# Altium schematic sheet 06_POWER-INPUT.SchDoc
size A4; CheckedBy: Inženjer 2; CompanyName: Byte Lab Grupa d.o.o.; Engineer: Matija Puskar; Organization: Byte Lab Grupa d.o.o.; Address1: Medarska 69/1, 10000 Zagreb, Croatia; DocumentNumber: 1; SheetNumber: 6; SheetTotal: 7; Web: www.byte-lab.com; ProjectName: P1X-0XX
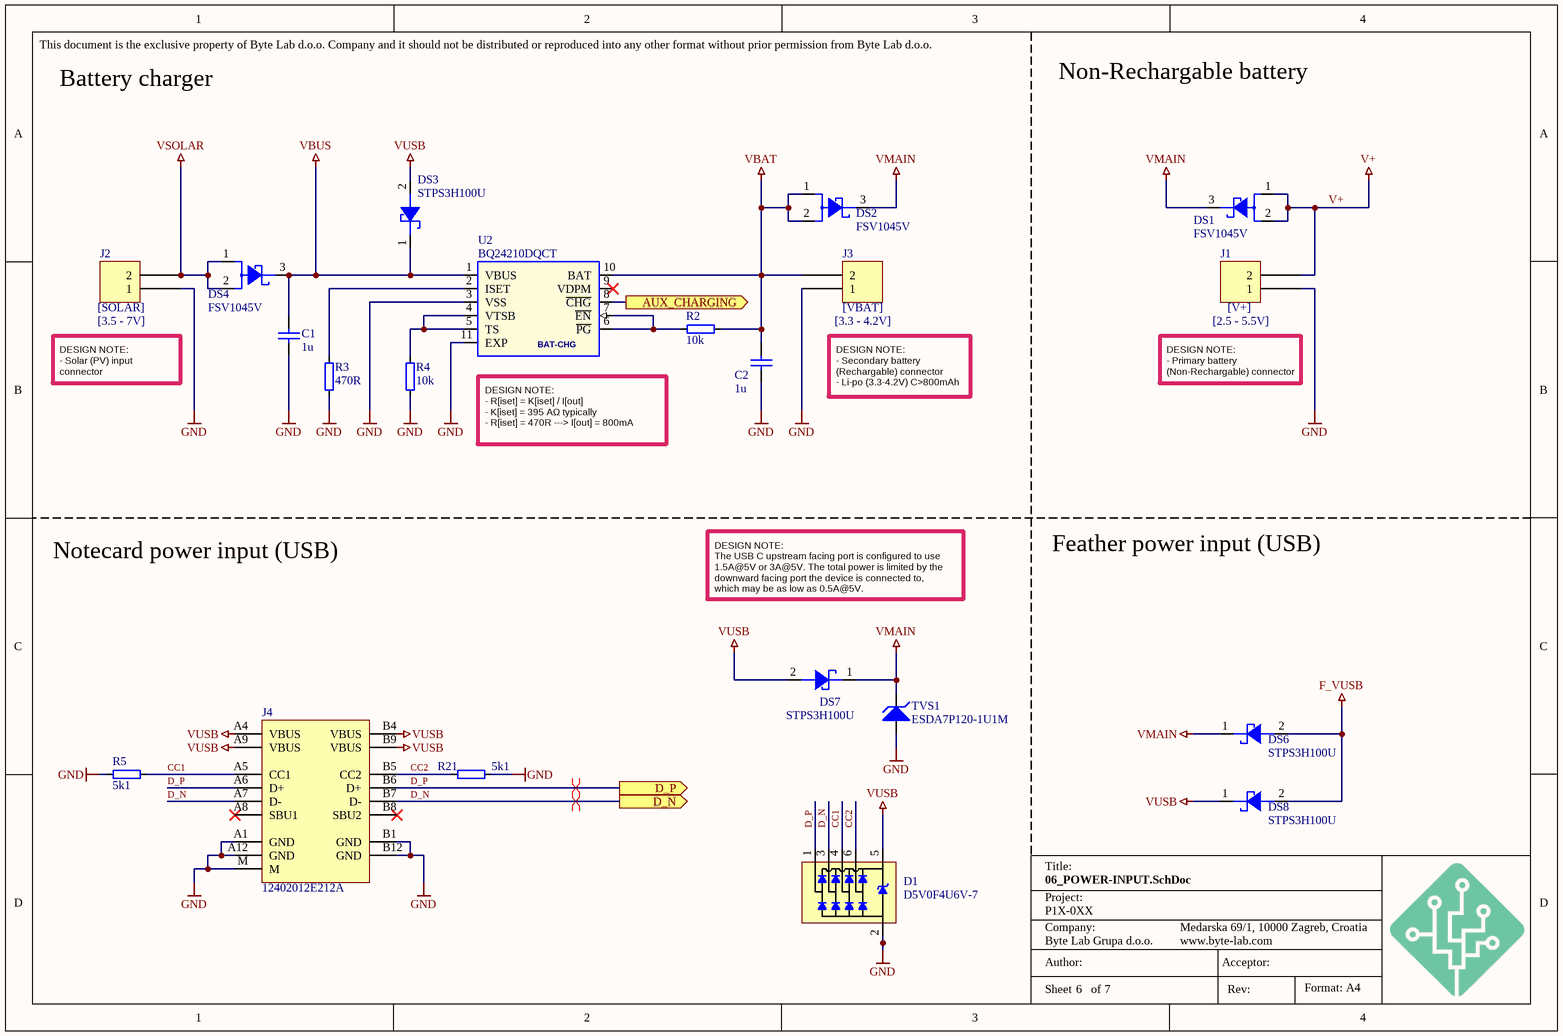
[diagram p0: 06_POWER-INPUT.SchDoc]

## Parts
C1  1u  [C-0603]
C2  1u  [C-0603]
D1  D5V0F4U6V-7  [SOT-563]
DS1  FSV1045V  [TO277-3]
DS2  FSV1045V  [TO277-3]
DS3  STPS3H100U  [SMB]
DS4  FSV1045V  [TO277-3]
DS6  STPS3H100U  [SMB]
DS7  STPS3H100U  [SMB]
DS8  STPS3H100U  [SMB]
J1  S2BPHSM4TBLFSN  [JST S2B-PH-SM4-TB]  (value not drawn)
J2  S2BPHSM4TBLFSN  [JST S2B-PH-SM4-TB]  (value not drawn)
J3  S2BPHSM4TBLFSN  [JST S2B-PH-SM4-TB]  (value not drawn)
J4  12402012E212A  [CONN_12402012E212A]
R2  10k  [R-0402]
R3  470R  [R-0402]
R4  10k  [R-0402]
R5  5k1  [R-0402]
R21  5k1  [R-0402]
TVS1  ESDA7P120-1U1M  [DIOC_160X100X60]
U2  BQ24210DQCT  [WSON10-EXP]

## Ports
AUX_CHARGING (out), D_N (out), D_P (out)

## Nets
F_VUSB: DS6.2(A) DS8.2(A)
GND: C1.1 C2.1 D1.2(GND) J1.1 J2.1 J3.1 J4.A1(GND) J4.A12(GND) J4.B1(GND) J4.B12(GND) J4.M R3.1 R4.1 R5.1 R21.2 TVS1.1(A) U2.3(VSS) U2.11(EXP)
V+: DS1.1(A1) DS1.2(A2) J1.2
VBAT: C2.2 DS2.1(A1) DS2.2(A2) J3.2 R2.2 U2.10(BAT)
VBUS: C1.2 DS3.1(C) DS4.3(C) U2.1(VBUS)
VMAIN: DS1.3(C) DS2.3(C) DS6.1(C) DS7.1(C) TVS1.2(K)
VSOLAR: DS4.1(A1) DS4.2(A2) J2.2
VUSB: D1.5(VDD) DS3.2(A) DS7.2(A) DS8.1(C) J4.A4(VBUS) J4.A9(VBUS) J4.B4(VBUS) J4.B9(VBUS)
AUX_CHARGING: U2.8(~{CHG}) ; port AUX_CHARGING
CC1: D1.4(CH3) J4.A5(CC1) R5.2
CC2: D1.6(CH4) J4.B5(CC2) R21.1
D_N: D1.3(CH2) J4.A7(D-) J4.B7(D-) ; port D_N
D_P: D1.1(CH1) J4.A6(D+) J4.B6(D+) ; port D_P
NetR2_1: R2.1 U2.6(~{PG}) U2.7(~{EN})
NetR3_2: R3.2 U2.2(ISET)
NetR4_2: R4.2 U2.4(VTSB) U2.5(TS)

Not connected (* = marked no-connect by the designer): J4 A8(SBU1)* B8(SBU2)*; U2 9(VDPM)*

## Layout directives
differential pair: D_N, D_P

## Notes on the sheet
- Battery charger
- Non-Rechargable battery
- (near J2) [SOLAR]
- (near J3) [VBAT]
- (near J1) [V+]
- DESIGN NOTE:
  - Solar (PV) input connector
- (near J2) [3.5 - 7V]
- (near J3) [3.3 - 4.2V]
- DESIGN NOTE:
  - Secondary battery (Rechargable) connector
  - Li-po (3.3-4.2V) C>800mAh
- DESIGN NOTE:
  - Primary battery (Non-Rechargable) connector
- (near J1) [2.5 - 5.5V]
- DESIGN NOTE:
  - R[iset] = K[iset] / I[out]
  - K[iset] = 395 AΩ typically
  - R[iset] = 470R ---> I[out] = 800mA
- Notecard power input (USB)
- Feather power input (USB)
- DESIGN NOTE:
  The USB C upstream facing port is configured to use 1.5A@5V or 3A@5V. The total power is limited by the downward facing port the device is connected to, which may be as low as 0.5A@5V.
- This document is the exclusive property of Byte Lab d.o.o. Company and it should not be distributed or reproduced into any other format without prior permission from Byte Lab d.o.o.
- Project:
- Title:
- Author:
- Company:
- Acceptor:
- Format: A4
- Sheet
- of
- Rev:
- (in symbol BAT-CHARGE - BQ24210DQCT) BAT-CHG

## Library data of the parts
C1 C2 = C0603-1u-25V-X5R: Capacitor ceramic 1u ±10% X5R 25V; Manufacturer: Yageo; BL Part Number: 2006-223; Manufacturer Part Number: CC0603KRX5R8BB105; Drawn_By: Hamin; Checked_By: Golubic; Supplier 1: Digi-Key; Supplier Part Number 1: 311-1445-1-ND; Note: *; DateModified: 2022-10-07
D1 = D5V0F4U6V-7: TVS DIODE 5.5VWM 12VC SOT563; BL Part Number: 2010-391; Manufacturer: Diodes Incorporated; Drawn_By: Duracic; Checked_By: Hrastic; Note: *; Manufacturer Part Number: D5V0F4U6V-7; DateModified: 21-01-2026; Supplier 1: *; Supplier Part Number 1: *
DS1 DS2 DS4 = SCHOTTKY - FSV1045V - 10A/45V: DIODO SCHOTTKY 10A 45V FSV1045V TO277-3 SMT; BL Part Number: 2007-712; Manufacturer: onsemi; Drawn_By: Blues Wireless; Supplier 1: Digi-Key; Supplier Part Number 1: FSV1045VCT-ND; Manufacturer Part Number: FSV1045V
DS3 DS6-DS8 = SCHOTTKY-STPS3H100U - 3A/100V: DIODO SCHOTTKY 3A 100V STPS3H100U SMB SMT; Manufacturer: STMicroelectronics; BL Part Number: 2007-711; Drawn_By: Blues Wireless; Supplier 1: Digi-Key; Supplier Part Number 1: 497-10392-1-ND; Manufacturer Part Number: STPS3H100U
J1-J3 = S2BPHSM4TBLFSN: PH SMT SIDE ENTRY HDR 2W; Manufacturer: JST; Manufacturer Part Number: S2B-PH-SM4-K-TB (LF)(SN); BL Part Number: 2007-662; Drawn_By: Blues Wireless; Supplier 1: Digi-Key; Supplier Part Number 1: *
J4 = Conn USB C 12402012E212A: CONN RCP USB2.0 TYP C 24P SMD RA; BL Part Number: 2008-437; Manufacturer: Amphenol; Drawn_By: Anic-Ivicic; Checked_By: Hlupic; Note: *; Manufacturer Part Number: 12402012E212A; DateModified: 19-03-2024; Supplier 1: Digi-Key; Supplier Part Number 1: 664-12402012E212ATR-ND
R2 R4 = R0402-10k-1: Resistor 10k ±1% 0402; BL Part Number: 2000-729; Checked_By: Dodig; Drawn_By: Puskar; Supplier 1: Digi-Key; Manufacturer: N/A; Manufacturer Part Number: N/A; Supplier Part Number 1: 311-10.0KLRCT-ND; DateModified: 27-08-2013; Note: *
R3 = R0402-470R-1: Resistor 470R ±1% 0402; BL Part Number: 2001-420; Checked_By: Marsic; Drawn_By: Hamin; Supplier 1: Digi-Key; Manufacturer: N/A; Manufacturer Part Number: N/A; Supplier Part Number 1: 13-RC0402FR-13470RLCT-ND; DateModified: 10-07-2023; Note: *
R5 R21 = R0402-5k1-1: Resistor 5k1 ±1% 0402; BL Part Number: 2004-098; Checked_By: Hamin; Drawn_By: PuskarJ; Manufacturer Part Number: N/A; DateModified: 21-09-2018; Manufacturer: N/A; Note: *; Supplier 1: Digi-Key; Supplier Part Number 1: P5.10KLCT-ND
TVS1 = ESDA7P120-1U1M: TVS DIODE 5.5VWM 11.5VC 1610; Manufacturer: STMicroelectronics; BL Part Number: 2007-378; Checked_By: Kvesic; Drawn_By: Duracic; Manufacturer Part Number: ESDA7P120-1U1M; DateModified: 26-01-2026; Note: *; Supplier Part Number 1: *; Supplier 1: *
U2 = BAT-CHARGE - BQ24210DQCT: INTEGRATO BQ24210DQCT WSON10 TEXAS SMT; BL Part Number: 2005-527; Manufacturer: Texas Instruments; Drawn_By: Blues Wireless; Supplier 1: Digi-Key; Supplier Part Number 1: 296-28738-1-ND; Manufacturer Part Number: BQ24210DQCT